# EAGLE schematic AmbaSat-1 version 2.0 (EAGLE 7.6.0)
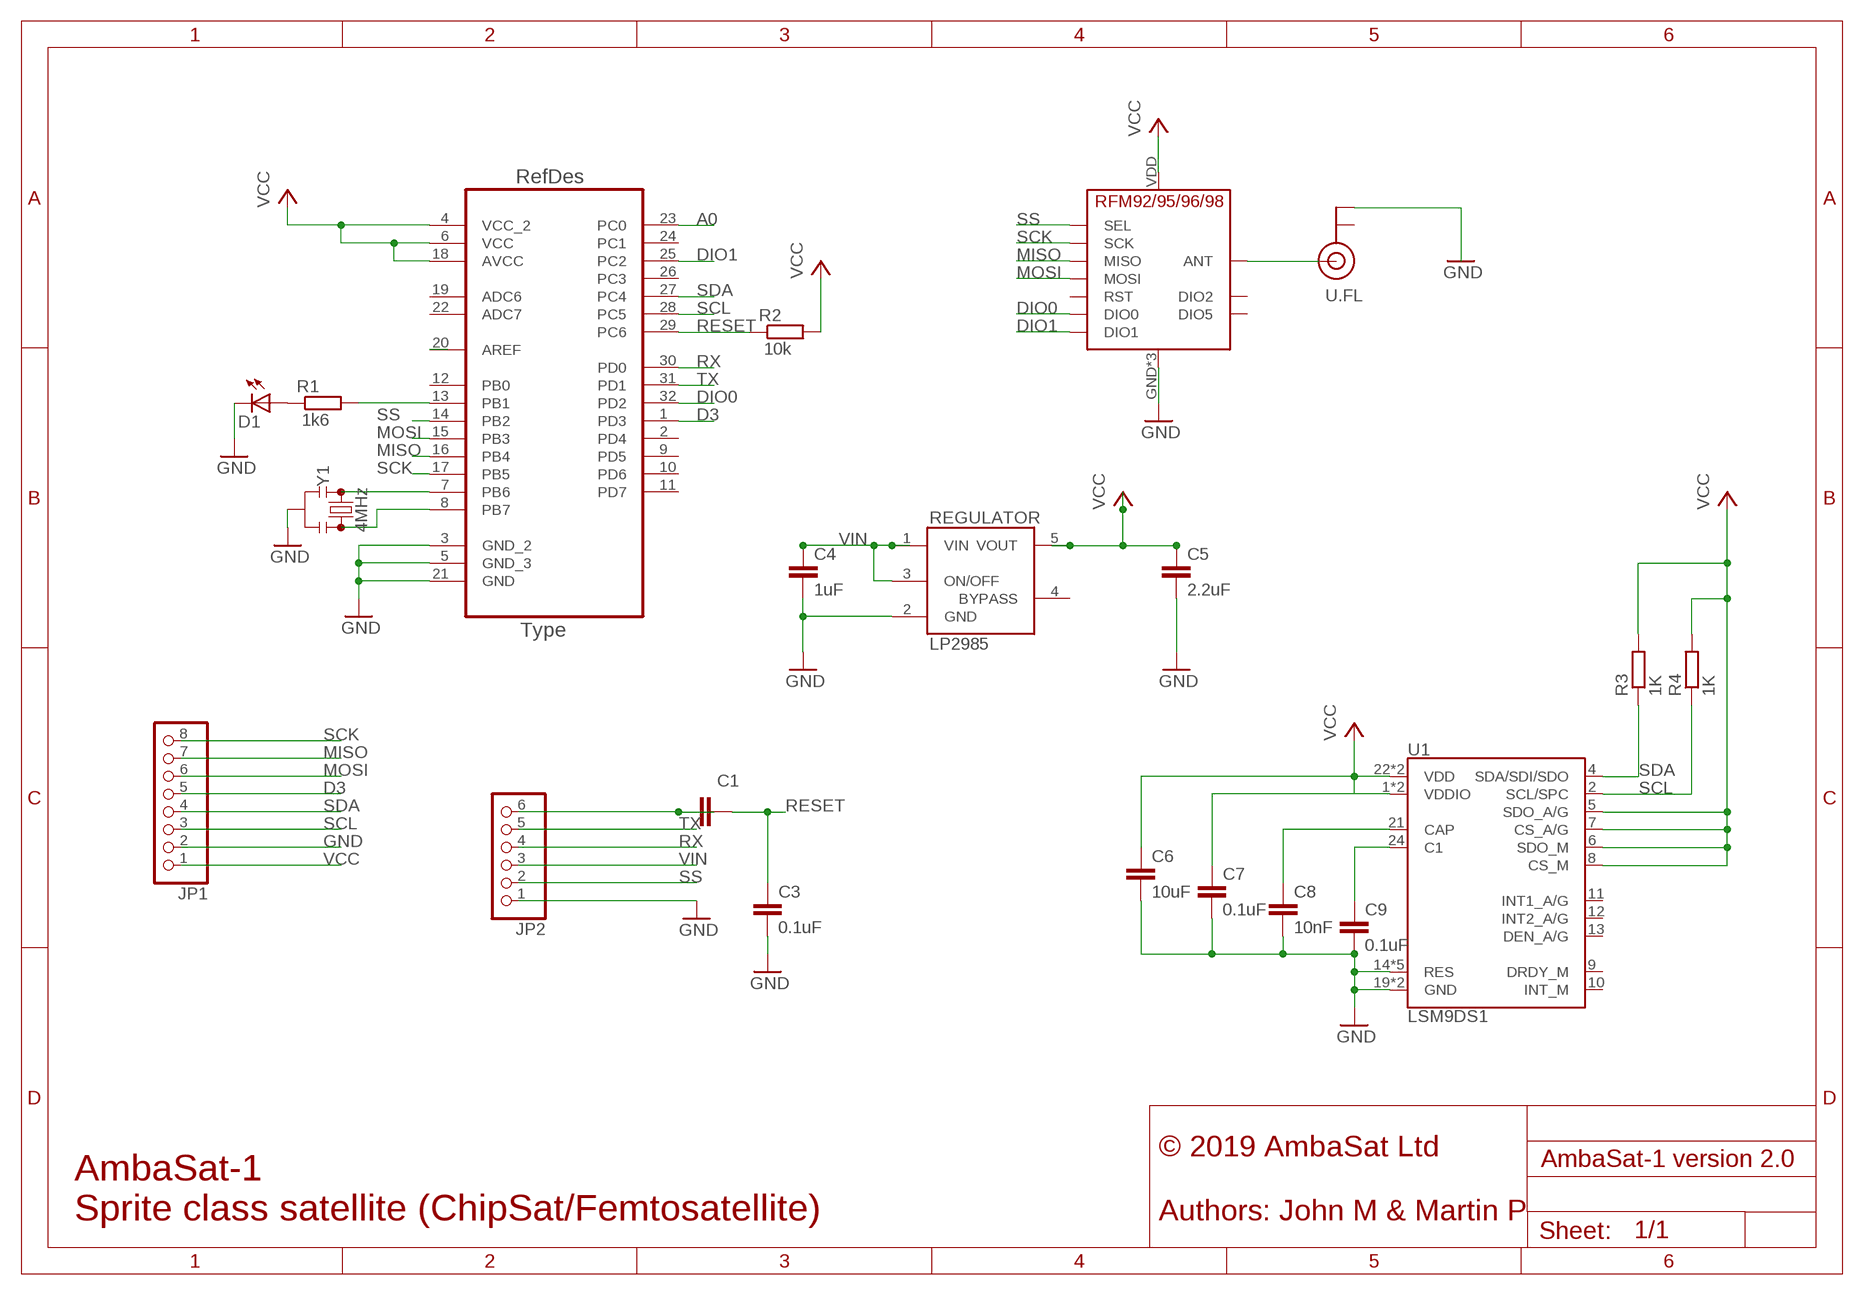
[diagram p0: schematic, sheet 1]

## Parts
ATMEGA328P-AU  ATMEGA328P-AU  [QFP80P900X900X120-32N]
C1  1uF  C-EUC0805K  [C0805K]
C3  0.1uF  C-EUC0805K  [C0805K]
C4  1uF  C-EUC0805K  [C0805K]
C5  2.2uF  C-EUC0805K  [C0805K]
C6  10uF  C-EUC0805K  [C0805K]
C7  0.1uF  C-EUC0805K  [C0805K]
C8  10nF  C-EUC0805K  [C0805K]
C9  0.1uF  C-EUC0805K  [C0805K]
D1  LEDCHIP-LED0805  [CHIP-LED0805]
JP1  PINHD-1X8  [1X08]
JP2  PINHD-1X6  [1X06]
R1  1k6  R-EU_M0805  [M0805]
R2  10k  R-EU_M0805  [M0805]
R3  1K  R-EU_M0805  [M0805]
R4  1K  R-EU_M0805  [M0805]
REGULATOR  LP2985AIM5-3.3  [SOT25]
RFM95  RFM95  [RFM95]
U1  LSM9DS1  [LGA24-8X4]
U.FL  U.FL  [U.FL]
Y1  4MHz  RESONATOR-4MHZSMD-4.5X2  [RESONATOR-SMD-4.5X2.0]

## Nets
A0: ATMEGA328P-AU.23(PC0)
AREF: ATMEGA328P-AU.20(AREF)
D3: ATMEGA328P-AU.1(PD3) JP1.5
DIO0: ATMEGA328P-AU.32(PD2) RFM95.DIO0
DIO1: ATMEGA328P-AU.25(PC2) RFM95.DIO1
GND: ATMEGA328P-AU.3(GND_2) ATMEGA328P-AU.5(GND_3) ATMEGA328P-AU.21(GND) C3.2 C4.2 C5.2 C6.2 C7.2 C8.2 C9.2 D1.C JP1.2 JP2.1 REGULATOR.2(GND) RFM95.GND RFM95.GND1(GND) RFM95.GND2(GND) U1.14(RES) U1.15(RES) U1.16(RES) U1.17(RES) U1.18(RES) U1.19(GND) U1.20(GND) Y1.2
MISO: ATMEGA328P-AU.16(PB4) JP1.7 RFM95.MISO
MOSI: ATMEGA328P-AU.15(PB3) JP1.6 RFM95.MOSI
N$1: ATMEGA328P-AU.7(PB6) Y1.1
N$2: ATMEGA328P-AU.8(PB7) Y1.3
N$3: ATMEGA328P-AU.13(PB1) R1.2
N$4: D1.A R1.1
N$5: RFM95.ANT
N$6: C1.2 JP2.6
N$7: C9.1 U1.24(C1)
N$8: C8.1 U1.21(CAP)
N$9: U.FL.2(GND)
RESET: ATMEGA328P-AU.29(PC6) C1.1 C3.1 R2.1
RX: ATMEGA328P-AU.30(PD0) JP2.4
SCK: ATMEGA328P-AU.17(PB5) JP1.8 RFM95.SCK
SCL: ATMEGA328P-AU.28(PC5) JP1.3 R4.1 U1.2(SCL/SPC)
SDA: ATMEGA328P-AU.27(PC4) JP1.4 R3.1 U1.4(SDA/SDI/SDO)
SS: ATMEGA328P-AU.14(PB2) JP2.2 RFM95.NSS(SEL)
TX: ATMEGA328P-AU.31(PD1) JP2.5
VCC: ATMEGA328P-AU.4(VCC_2) ATMEGA328P-AU.6(VCC) ATMEGA328P-AU.18(AVCC) C5.1 C6.1 C7.1 JP1.1 R2.2 R3.2 R4.2 REGULATOR.5(VOUT) RFM95.VDD(VCC) U1.1(VDDIO) U1.3(VDDIO) U1.5(SDO_A/G) U1.6(SDO_M) U1.7(CS_A/G) U1.8(CS_M) U1.22(VDD) U1.23(VDD)
VIN: C4.1 JP2.3 REGULATOR.1(VIN) REGULATOR.3(ON/OFF)
Unconnected: ATMEGA328P-AU.2(PD4) ATMEGA328P-AU.9(PD5) ATMEGA328P-AU.10(PD6) ATMEGA328P-AU.11(PD7) ATMEGA328P-AU.12(PB0) ATMEGA328P-AU.19(ADC6) ATMEGA328P-AU.22(ADC7) ATMEGA328P-AU.24(PC1) ATMEGA328P-AU.26(PC3) REGULATOR.4(BYPASS) RFM95.DIO2 RFM95.DIO5 RFM95.RST U1.9(DRDY_M) U1.10(INT_M) U1.11(INT1_A/G) U1.12(INT2_A/G) U1.13(DEN_A/G) U.FL.1(GND) U.FL.FEED(SIGNAL)

## Notes on the sheet
- AmbaSat-1  
  Sprite class satellite (ChipSat/Femtosatellite)
- © 2019 AmbaSat Ltd
  
  Authors: John M & Martin P

## Library data of the parts
ATMEGA328P-AU = Atmel-ATMEGA328P-AU:ATMEGA328P-AU; DESCRIPTION: 8-bit Microcontroller with In-System Programmable Flash; MPN: ATMEGA328P-AU; OC_FARNELL: 1715486; OC_NEWARK: 14R4631; PACKAGE: TQFP-32; SUPPLIER: Atmel
C1 C3-C9 = rcl:C-EU: CAPACITOR, European symbol
D1 = led:LED: LED OSRAM: - CHIPLED LG R971, LG N971, LY N971, LG Q971, LY Q971, LO R971, LY R971 LH N974, LH R974 LS Q976, LO Q976, LY Q976 LO Q996 - Hyper CHIPLED LW Q18S LB Q993, LB Q99A, LB R99A - SideLED LS A670, LO A670, LY A670, LG A670, LP A670 LB A673, LV A673, LT A673, LW A673 LH A674 LY A675 LS A676, LA A676, LO A676, LY A676, LW A676 LS A679, LY A679, LG A679 - Hyper Micro SIDELED® LS Y876, LA Y876, LO Y876, LY Y876 LT Y87S - SmartLED LW L88C, LW L88S LB L89C, LB L89S, LG L890 LS L89K, LO L89K, LY L89K LS L896, LA L896, LO L896, LY L896 - TOPLED LS T670, LO T670, LY T670, LG T670, LP T670 LSG T670, LSP T670, LSY T670, LOP T670, LYG T670 LG T671, LOG T671, LSG T671 LB T673, LV T673, LT T673, LW T673 LH T674 LS T676, LA T676, LO T676, LY T676, LB T676, LH T676, LSB T676, LW T676 LB T67C, LV T67C, LT T67C, LS T67K, LO T67K, LY T67K, LW E67C LS E67B, LA E67B, LO E67B, LY E67B, LB E67C, LV E67C, LT E67C LW T67C LS T679, LY T679, LG T679 LS T770, LO T770, LY T770, LG T770, LP T770 LB T773, LV T773, LT T773, LW T773 LH T774 LS E675, LA E675, LY E675, LS T675 LS T776, LA T776, LO T776, LY T776, LB T776 LHGB T686 LT T68C, LB T68C - Hyper Mini TOPLED® LB M676 - Mini TOPLED Santana® LG M470 LS M47K, LO M47K, LY M47K Source: http://www.osram.convergy.de LUXEON: - LUMILED® LXK2-PW12-R00, LXK2-PW12-S00, LXK2-PW14-U00, LXK2-PW14-V00 LXK2-PM12-R00, LXK2-PM12-S00, LXK2-PM14-U00 LXK2-PE12-Q00, LXK2-PE12-R00, LXK2-PE12-S00, LXK2-PE14-T00, LXK2-PE14-U00 LXK2-PB12-K00, LXK2-PB12-L00, LXK2-PB12-M00, LXK2-PB14-N00, LXK2-PB14-P00, LXK2-PB14-Q00 LXK2-PR12-L00, LXK2-PR12-M00, LXK2-PR14-Q00, LXK2-PR14-R00 LXK2-PD12-Q00, LXK2-PD12-R00, LXK2-PD12-S00 LXK2-PH12-R00, LXK2-PH12-S00 LXK2-PL12-P00, LXK2-PL12-Q00, LXK2-PL12-R00 Source: www.luxeon.com KINGBRIGHT: KA-3528ASYC Source: www.kingbright.com
JP1 = pinhead:PINHD-1X8: PIN HEADER
JP2 = pinhead:PINHD-1X6: PIN HEADER
R1-R4 = rcl:R-EU_: RESISTOR, European symbol
REGULATOR = LP2985:LP2985: LP2985-N Micropower 150 mA Low-Noise Ultra Low-Dropout Regulator
RFM95 = _c2h:RFM95
U1 = LSM9DS1:LSM9DS1: LSM9DS1 3D accelerometer, gyroscope & magnetometer The LSM9DS1 is a system-in-package featuring a 3D digital linear acceleration sensor, a 3D digital angular rate sensor, and a 3D digital magnetic sensor. The LSM9DS1 has a linear acceleration full scale of ±2g/±4g/±8/±16 g, a magnetic field full scale of ±4/±8/±12/±16 gauss and an angular rate of ±245/±500/±2000 dps. The LSM9DS1 includes an I2 C serial bus interface supporting standard and fast mode (100 kHz and 400 kHz) and an SPI serial standard interface. Magnetic, accelerometer and gyroscope sensing can be enabled or set in power-down mode separately for smart power management. The LSM9DS1 is available in a plastic land grid array package (LGA) and it is guaranteed to operate over an extended temperature range from -40 °C to +85 °C.; PROD_ID: IC-12536
U.FL = SparkFun-Connectors:U.FL: SMD Antenna Connector - U.FL 2mm height, 3.0mm x 3.0mm receptacle size. SparkFun Products: SparkFun WiFi Shield - ESP8266 <https://www.sparkfun.com/products/13287> SparkFun ESP8266 Thing <https://www.sparkfun.com/products/13231> SparkFun MiniGen - Pro Mini Signal Generator Shield <https://www.sparkfun.com/products/11420>; PROD_ID: CONN-09193; SF_ID: WRL-09144
Y1 = SparkFun-Clocks:RESONATOR-4MHZ: 4MHz Resonator Digikey Example <http://www.digikey.com/product-search/en?keywords=490-1200-1-ND> Frequency: 4MHz Frequency Stability: ±0.2% Frequency Tolerance: ±0.5% Capacitance: 15pF SparkFun Products SparkFun BadgerHack <https://www.sparkfun.com/products/13333>; PROD_ID: XTAL-12492